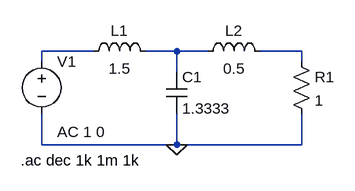
[diagram p0: schematic EJ4.asc]
EJ4.asc, the LTspice schematic file:
Version 4
SHEET 1 880 680
WIRE 32 80 -48 80
WIRE 160 80 112 80
WIRE 208 80 160 80
WIRE 352 80 288 80
WIRE -48 96 -48 80
WIRE 352 96 352 80
WIRE 160 112 160 80
WIRE -48 224 -48 176
WIRE 160 224 160 176
WIRE 160 224 -48 224
WIRE 352 224 352 176
WIRE 352 224 160 224
FLAG 160 224 0
SYMBOL res 336 80 R0
SYMATTR InstName R1
SYMATTR Value 1
SYMBOL voltage -48 80 R0
WINDOW 123 24 124 Left 2
WINDOW 39 0 0 Left 0
SYMATTR Value2 AC 1 0
SYMATTR InstName V1
SYMATTR Value ""
SYMBOL ind 16 96 R270
WINDOW 0 32 56 VTop 2
WINDOW 3 5 56 VBottom 2
SYMATTR InstName L1
SYMATTR Value 1.5
SYMBOL ind 192 96 R270
WINDOW 0 32 56 VTop 2
WINDOW 3 5 56 VBottom 2
SYMATTR InstName L2
SYMATTR Value 0.5
SYMBOL cap 144 112 R0
SYMATTR InstName C1
SYMATTR Value 1.3333
TEXT -80 248 Left 2 !.ac dec 1k 1m 1k

The netlist it stands for:
* EJ4.asc
R1 N003 0 1
V1 N001 0 AC 1 0
L1 N001 N002 1.5
L2 N002 N003 0.5
C1 N002 0 1.3333
.ac dec 1k 1m 1k
.backanno
.end